# EAGLE board video-max5-revG (EAGLE 5.11)
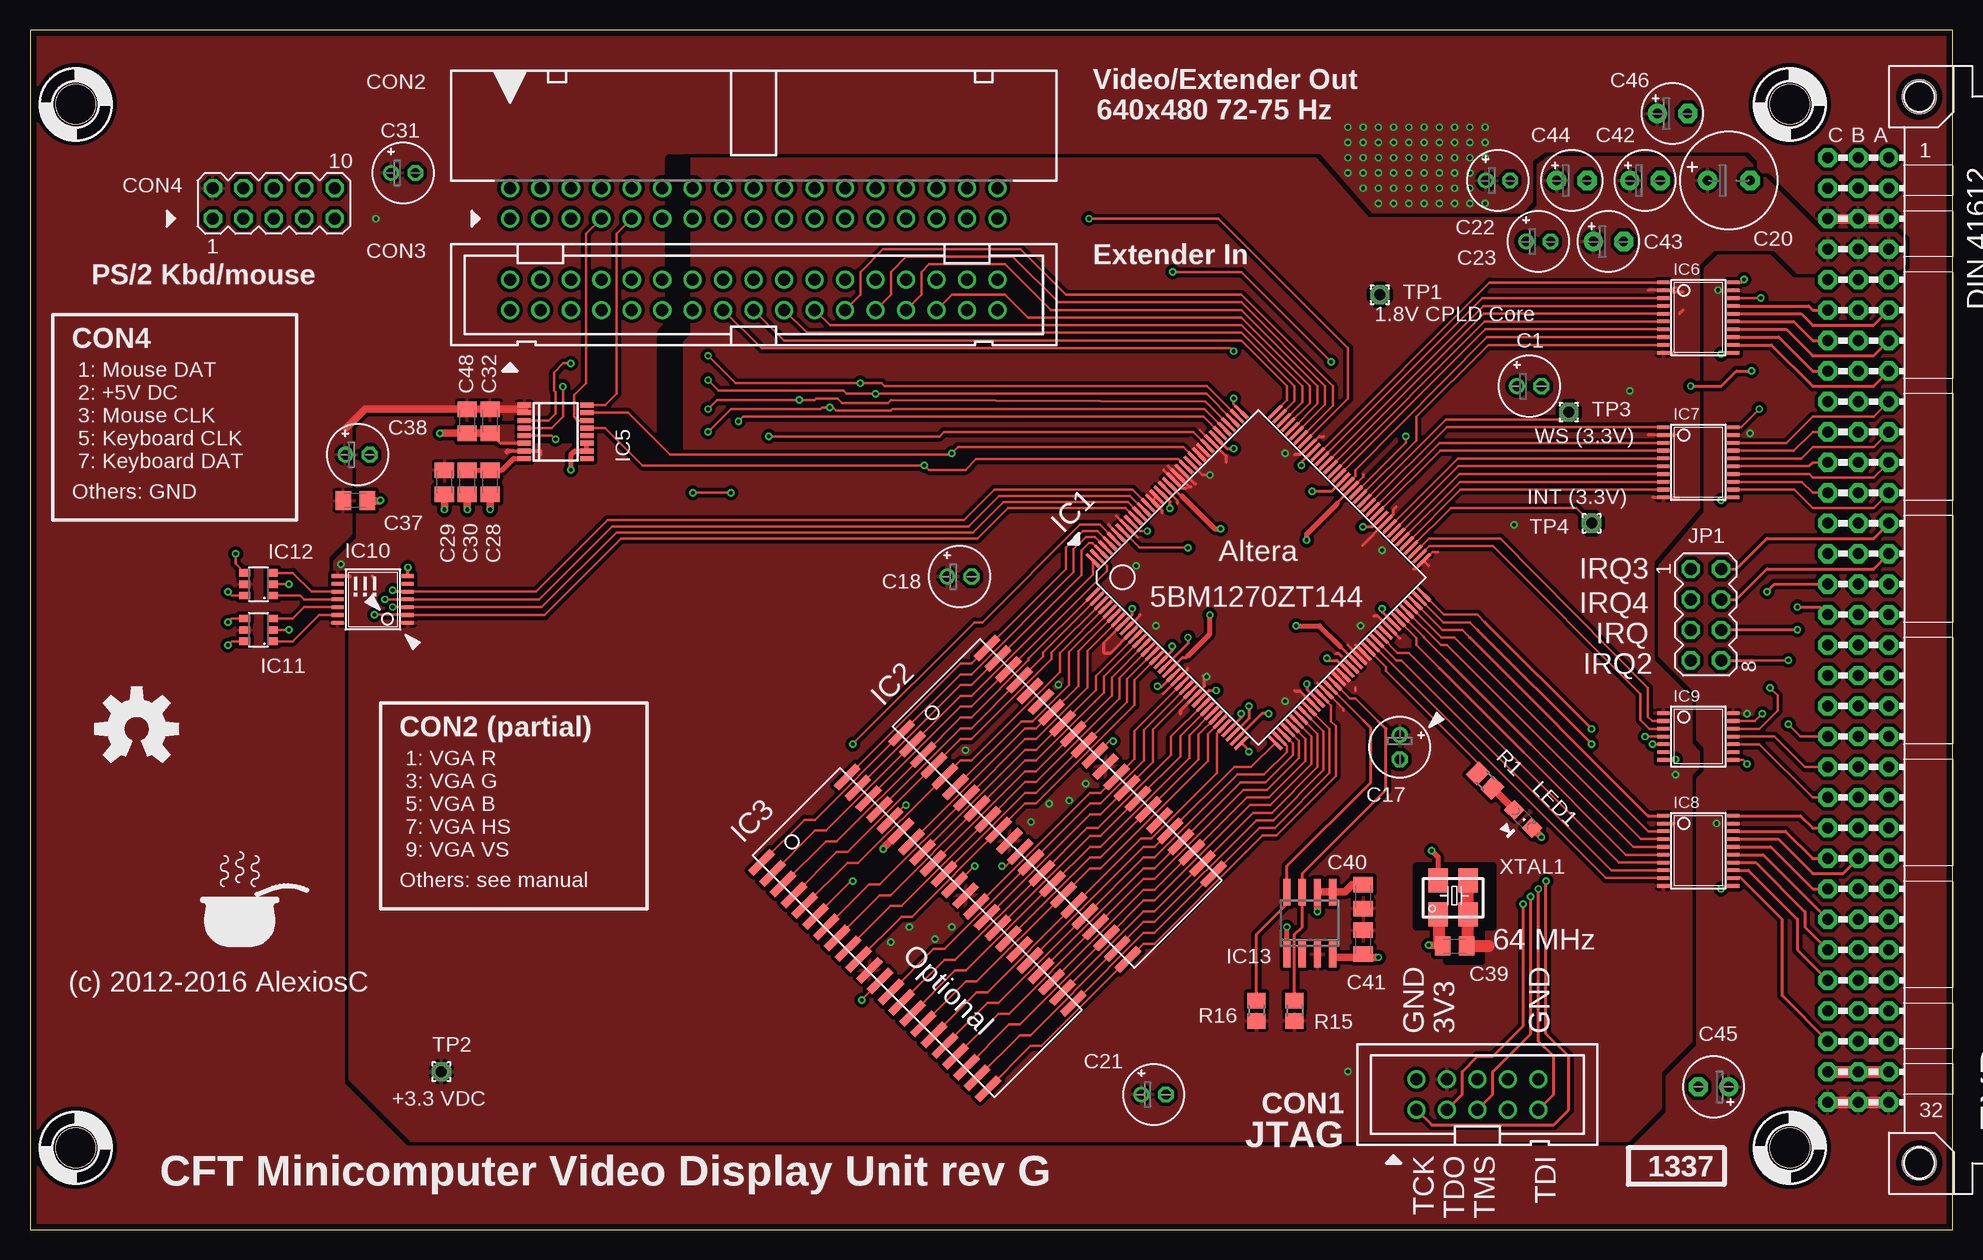
[diagram p5: board, top side]
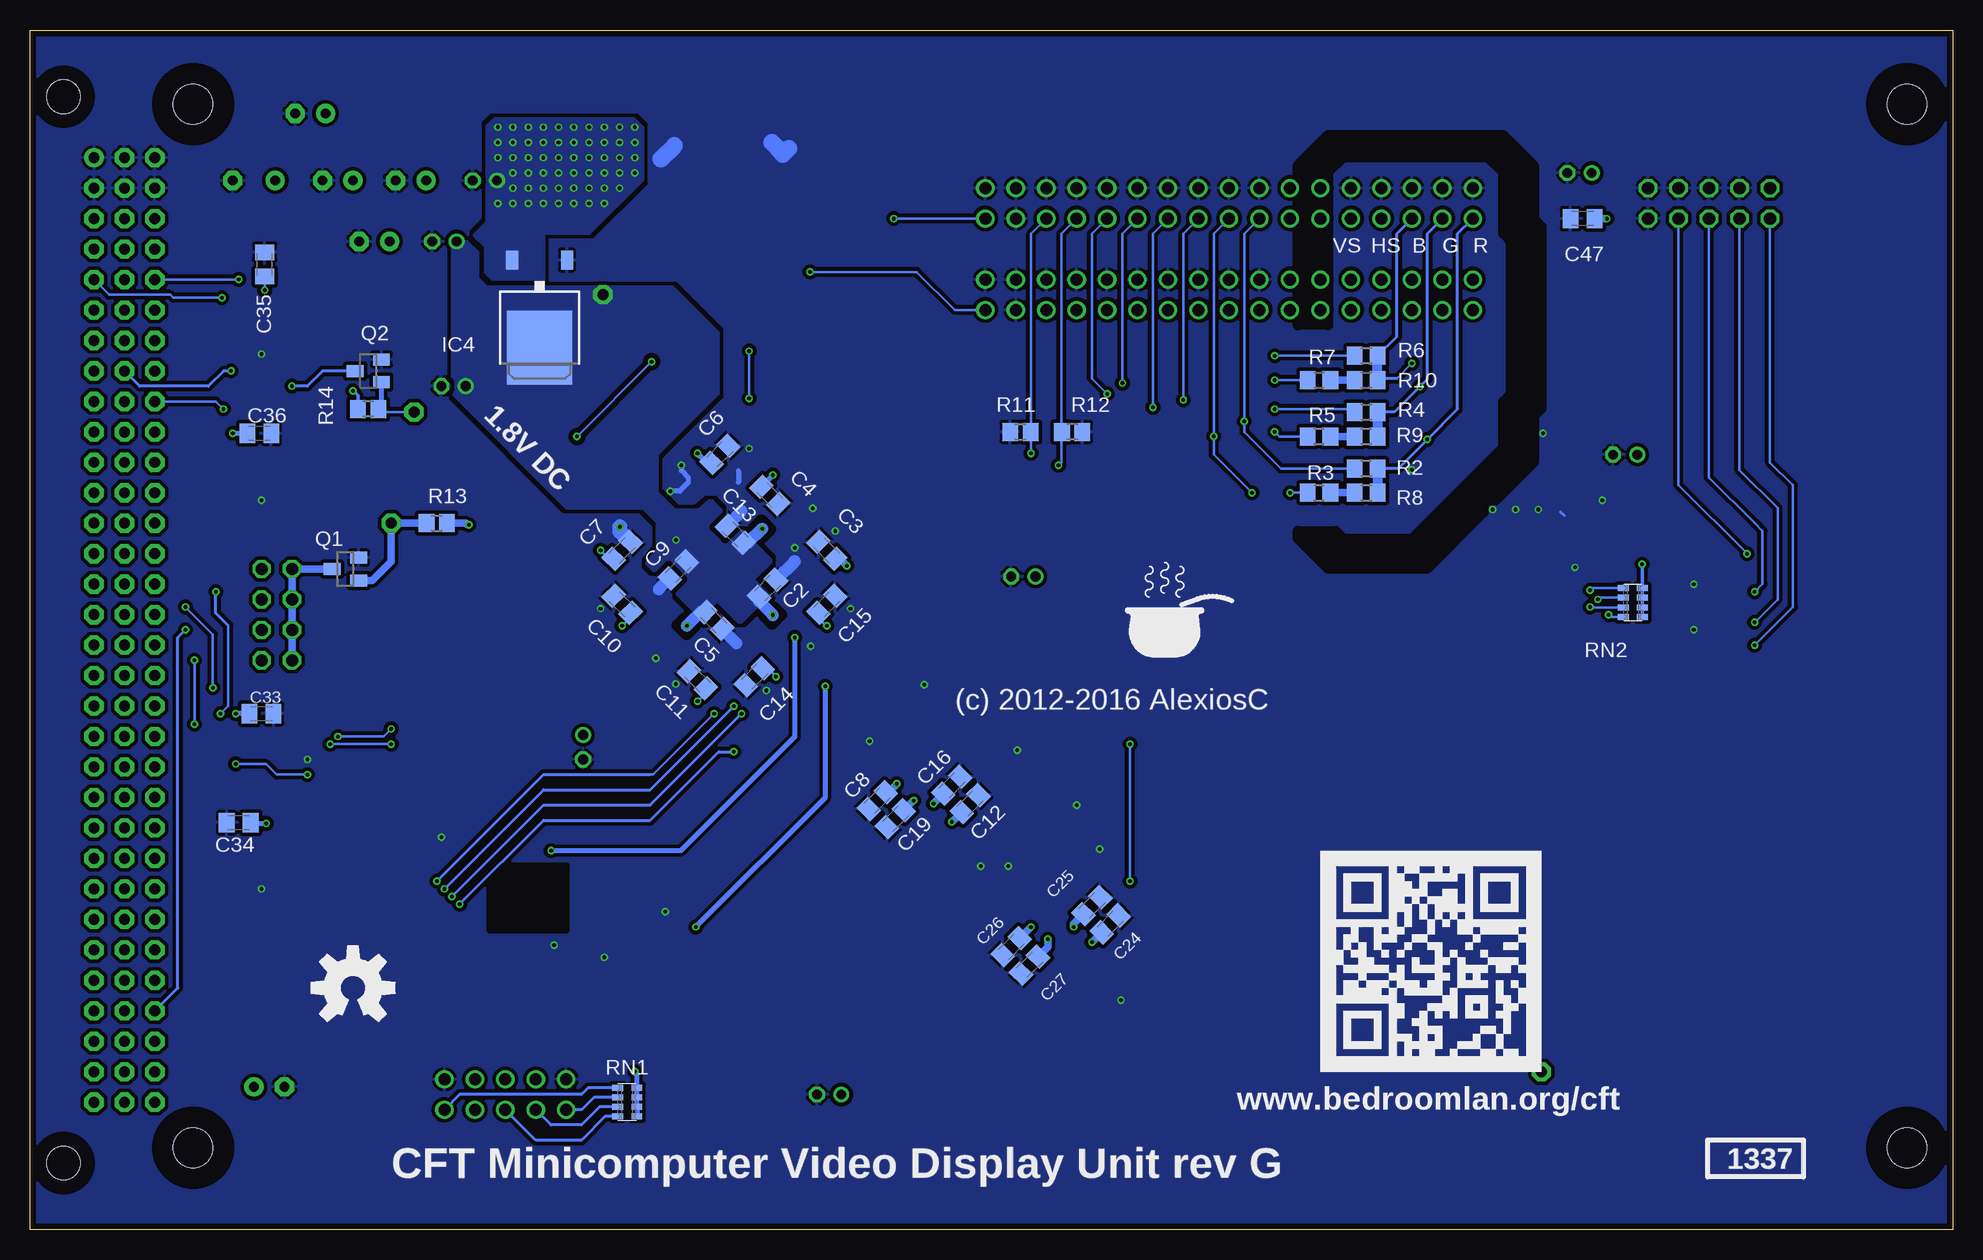
[diagram p6: board, bottom side, seen from below]

Size 160.27 x 100.03 mm. Coordinates in mm from the lower left corner, seen from the top.
Copper layers (1*16): Top 0.035mm / dielectric 1.5mm / Bottom 0.035mm
Design rules "smart-prototyping-1layer": minimum track width 7mil, minimum drill 12mil, track to track 7mil, track to pad 7mil, pad to pad 7mil, via to via 7mil, smd to smd 0mil, copper to edge 20mil, drill to drill 10mil, minimum pad ring 10mil, minimum via ring 6mil, stop-mask expansion 2mil, vias tented up to drill 25mil, thermal gap 10mil
Net classes: 0 default: width 0.203 mm, clearance 0.152 mm; 1 low power: width 1.27 mm, clearance 0.203 mm; 2 Power Rail: width 0.61 mm, clearance 0.254 mm; 3 3.3V power: width 0.61 mm, clearance 0.203 mm; 4 Analogue: width 0.406 mm, clearance 0.203 mm
tRestrict: area 115.6,25.2 to 121.6,30; area 118.1,22.4 to 121,26.2; area 115.6,25.6 to 121.6,30.3; area 115.9,25.2 to 121.9,30; area 115.9,25.6 to 121.9,30.3; area 41.9,65.9 to 45.7,67.2; area 52.7,64.7 to 54.6,89.3
bRestrict: area 98.6,57.8 to 99.9,59.2; area 104.9,49.6 to 106.3,51; area 97.7,50.5 to 99.1,51.9; area 115.6,25.6 to 121.6,30.3; area 115.6,25 to 121.9,30.3; area 34.3,55.1 to 54.6,91.3

## Footprints (pad centres in the part's own frame; a part is rotated, then mirrored left to right if it is on the bottom)
E2-5 = drill 0.813 pad 1.27 round: + -1.016,0 | drill 0.813 pad 1.27 octagon: - 1.016,0
C0805K = smd 1.3 x 1.6: 1 -1,0; 2 1,0
E3,5-8 = drill 0.813 pad 1.6 round: + -1.778,0 | drill 0.813 pad 1.6 octagon: - 1.778,0
E2,5-5 = drill 0.813 pad 1.6 round: + -1.27,0 | drill 0.813 pad 1.6 octagon: - 1.27,0
SHROUDED-HEADER-2X5-2.5MM = drill 1 pad 1.422 round: 1 -5.08,-1.27; 2 -5.08,1.27; 3 -2.54,-1.27; 4 -2.54,1.27; 5 0,-1.27; 6 0,1.27; 7 2.54,-1.27; 8 2.54,1.27; 9 5.08,-1.27; 10 5.08,1.27
PAK100/2500-5-34 = drill 1 pad 1.422 round: 1 -20.32,-1.27; 2 -20.32,1.27; 3 -17.78,-1.27; 4 -17.78,1.27; 5 -15.24,-1.27; 6 -15.24,1.27; 7 -12.7,-1.27; 8 -12.7,1.27; 9 -10.16,-1.27; 10 -10.16,1.27; 11 -7.62,-1.27; 12 -7.62,1.27; 13 -5.08,-1.27; 14 -5.08,1.27; 15 -2.54,-1.27; 16 -2.54,1.27; 17 0,-1.27; 18 0,1.27; 19 2.54,-1.27; 20 2.54,1.27; 21 5.08,-1.27; 22 5.08,1.27; 23 7.62,-1.27; 24 7.62,1.27; 25 10.16,-1.27; 26 10.16,1.27; 27 12.7,-1.27; 28 12.7,1.27; 29 15.24,-1.27; 30 15.24,1.27; 31 17.78,-1.27; 32 17.78,1.27; 33 20.32,-1.27; 34 20.32,1.27
PAK100/2500-34 = drill 1 pad 1.422 round: 1 -20.32,-1.27; 2 -20.32,1.27; 3 -17.78,-1.27; 4 -17.78,1.27; 5 -15.24,-1.27; 6 -15.24,1.27; 7 -12.7,-1.27; 8 -12.7,1.27; 9 -10.16,-1.27; 10 -10.16,1.27; 11 -7.62,-1.27; 12 -7.62,1.27; 13 -5.08,-1.27; 14 -5.08,1.27; 15 -2.54,-1.27; 16 -2.54,1.27; 17 0,-1.27; 18 0,1.27; 19 2.54,-1.27; 20 2.54,1.27; 21 5.08,-1.27; 22 5.08,1.27; 23 7.62,-1.27; 24 7.62,1.27; 25 10.16,-1.27; 26 10.16,1.27; 27 12.7,-1.27; 28 12.7,1.27; 29 15.24,-1.27; 30 15.24,1.27; 31 17.78,-1.27; 32 17.78,1.27; 33 20.32,-1.27; 34 20.32,1.27
MA05-2 = drill 1.016 octagon: 1 -5.08,-1.27; 2 -5.08,1.27; 3 -2.54,-1.27; 4 -2.54,1.27; 5 0,-1.27; 6 0,1.27; 7 2.54,-1.27; 8 2.54,1.27; 9 5.08,-1.27; 10 5.08,1.27
VG96K = drill 0.914 pad 1.6 round: A1 154.94,39.37 | drill 0.914 pad 1.6 octagon: A2 154.94,36.83; A3 154.94,34.29; A4 154.94,31.75; A5 154.94,29.21; A6 154.94,26.67; A7 154.94,24.13; A8 154.94,21.59; A9 154.94,19.05; A10 154.94,16.51; A11 154.94,13.97; A12 154.94,11.43; A13 154.94,8.89; A14 154.94,6.35; A15 154.94,3.81; A16 154.94,1.27; A17 154.94,-1.27; A18 154.94,-3.81; A19 154.94,-6.35; A20 154.94,-8.89; A21 154.94,-11.43; A22 154.94,-13.97; A23 154.94,-16.51; A24 154.94,-19.05; A25 154.94,-21.59; A26 154.94,-24.13; A27 154.94,-26.67; A28 154.94,-29.21; A29 154.94,-31.75; A30 154.94,-34.29; A31 154.94,-36.83; A32 154.94,-39.37; B1 152.4,39.37; B2 152.4,36.83; B3 152.4,34.29; B4 152.4,31.75; B5 152.4,29.21; B6 152.4,26.67; B7 152.4,24.13; B8 152.4,21.59; B9 152.4,19.05; B10 152.4,16.51; B11 152.4,13.97; B12 152.4,11.43; B13 152.4,8.89; B14 152.4,6.35; B15 152.4,3.81; B16 152.4,1.27; B17 152.4,-1.27; B18 152.4,-3.81; B19 152.4,-6.35; B20 152.4,-8.89; B21 152.4,-11.43; B22 152.4,-13.97; B23 152.4,-16.51; B24 152.4,-19.05; B25 152.4,-21.59; B26 152.4,-24.13; B27 152.4,-26.67; B28 152.4,-29.21; B29 152.4,-31.75; B30 152.4,-34.29; B31 152.4,-36.83; B32 152.4,-39.37; C1 149.86,39.37; C2 149.86,36.83; C3 149.86,34.29; C4 149.86,31.75; C5 149.86,29.21; C6 149.86,26.67; C7 149.86,24.13; C8 149.86,21.59; C9 149.86,19.05; C10 149.86,16.51; C11 149.86,13.97; C12 149.86,11.43; C13 149.86,8.89; C14 149.86,6.35; C15 149.86,3.81; C16 149.86,1.27; C17 149.86,-1.27; C18 149.86,-3.81; C19 149.86,-6.35; C20 149.86,-8.89; C21 149.86,-11.43; C22 149.86,-13.97; C23 149.86,-16.51; C24 149.86,-19.05; C25 149.86,-21.59; C26 149.86,-24.13; C27 149.86,-26.67; C28 149.86,-29.21; C29 149.86,-31.75; C30 149.86,-34.29; C31 149.86,-36.83; C32 149.86,-39.37 | hole 2.794: 157.48,44.45; 157.48,-44.45
TQFP144@1 = smd 0.27 x 1.5: 1 -8.75,-10.75; 2 -8.25,-10.75; 3 -7.75,-10.75; 4 -7.25,-10.75; 5 -6.75,-10.75; 6 -6.25,-10.75; 7 -5.75,-10.75; 8 -5.25,-10.75; 9 -4.75,-10.75; 10 -4.25,-10.75; 11 -3.75,-10.75; 12 -3.25,-10.75; 13 -2.75,-10.75; 14 -2.25,-10.75; 15 -1.75,-10.75; 16 -1.25,-10.75; 17 -0.75,-10.75; 18 -0.25,-10.75; 19 0.25,-10.75; 20 0.75,-10.75; 21 1.25,-10.75; 22 1.75,-10.75; 23 2.25,-10.75; 24 2.75,-10.75; 25 3.25,-10.75; 26 3.75,-10.75; 27 4.25,-10.75; 28 4.75,-10.75; 29 5.25,-10.75; 30 5.75,-10.75; 31 6.25,-10.75; 32 6.75,-10.75; 33 7.25,-10.75; 34 7.75,-10.75; 35 8.25,-10.75; 36 8.75,-10.75; 73 8.75,10.75; 74 8.25,10.75; 75 7.75,10.75; 76 7.25,10.75; 77 6.75,10.75; 78 6.25,10.75; 79 5.75,10.75; 80 5.25,10.75; 81 4.75,10.75; 82 4.25,10.75; 83 3.75,10.75; 84 3.25,10.75; 85 2.75,10.75; 86 2.25,10.75; 87 1.75,10.75; 88 1.25,10.75; 89 0.75,10.75; 90 0.25,10.75; 91 -0.25,10.75; 92 -0.75,10.75; 93 -1.25,10.75; 94 -1.75,10.75; 95 -2.25,10.75; 96 -2.75,10.75; 97 -3.25,10.75; 98 -3.75,10.75; 99 -4.25,10.75; 100 -4.75,10.75; 101 -5.25,10.75; 102 -5.75,10.75; 103 -6.25,10.75; 104 -6.75,10.75; 105 -7.25,10.75; 106 -7.75,10.75; 107 -8.25,10.75; 108 -8.75,10.75 | smd 1.5 x 0.27: 37 10.75,-8.75; 38 10.75,-8.25; 39 10.75,-7.75; 40 10.75,-7.25; 41 10.75,-6.75; 42 10.75,-6.25; 43 10.75,-5.75; 44 10.75,-5.25; 45 10.75,-4.75; 46 10.75,-4.25; 47 10.75,-3.75; 48 10.75,-3.25; 49 10.75,-2.75; 50 10.75,-2.25; 51 10.75,-1.75; 52 10.75,-1.25; 53 10.75,-0.75; 54 10.75,-0.25; 55 10.75,0.25; 56 10.75,0.75; 57 10.75,1.25; 58 10.75,1.75; 59 10.75,2.25; 60 10.75,2.75; 61 10.75,3.25; 62 10.75,3.75; 63 10.75,4.25; 64 10.75,4.75; 65 10.75,5.25; 66 10.75,5.75; 67 10.75,6.25; 68 10.75,6.75; 69 10.75,7.25; 70 10.75,7.75; 71 10.75,8.25; 72 10.75,8.75; 109 -10.75,8.75; 110 -10.75,8.25; 111 -10.75,7.75; 112 -10.75,7.25; 113 -10.75,6.75; 114 -10.75,6.25; 115 -10.75,5.75; 116 -10.75,5.25; 117 -10.75,4.75; 118 -10.75,4.25; 119 -10.75,3.75; 120 -10.75,3.25; 121 -10.75,2.75; 122 -10.75,2.25; 123 -10.75,1.75; 124 -10.75,1.25; 125 -10.75,0.75; 126 -10.75,0.25; 127 -10.75,-0.25; 128 -10.75,-0.75; 129 -10.75,-1.25; 130 -10.75,-1.75; 131 -10.75,-2.25; 132 -10.75,-2.75; 133 -10.75,-3.25; 134 -10.75,-3.75; 135 -10.75,-4.25; 136 -10.75,-4.75; 137 -10.75,-5.25; 138 -10.75,-5.75; 139 -10.75,-6.25; 140 -10.75,-6.75; 141 -10.75,-7.25; 142 -10.75,-7.75; 143 -10.75,-8.25; 144 -10.75,-8.75
SOJ44-4 = smd 0.635 x 2.54: 1 -13.335,-5.029; 2 -12.065,-5.029; 3 -10.795,-5.029; 4 -9.525,-5.029; 5 -8.255,-5.029; 6 -6.985,-5.029; 7 -5.715,-5.029; 8 -4.445,-5.029; 9 -3.175,-5.029; 10 -1.905,-5.029; 11 -0.635,-5.029; 12 0.635,-5.029; 13 1.905,-5.029; 14 3.175,-5.029; 15 4.445,-5.029; 16 5.715,-5.029; 17 6.985,-5.029; 18 8.255,-5.029; 19 9.525,-5.029; 20 10.795,-5.029; 21 12.065,-5.029; 22 13.335,-5.029; 23 13.335,5.029; 24 12.065,5.029; 25 10.795,5.029; 26 9.525,5.029; 27 8.255,5.029; 28 6.985,5.029; 29 5.715,5.029; 30 4.445,5.029; 31 3.175,5.029; 32 1.905,5.029; 33 0.635,5.029; 34 -0.635,5.029; 35 -1.905,5.029; 36 -3.175,5.029; 37 -4.445,5.029; 38 -5.715,5.029; 39 -6.985,5.029; 40 -8.255,5.029; 41 -9.525,5.029; 42 -10.795,5.029; 43 -12.065,5.029; 44 -13.335,5.029
TO252 = smd 1 x 1.6: 1 -2.28,-4.8; 2 2.28,-4.8 | smd 5.4 x 6.2: 3 0,2.5
SSOP16 = smd 0.419 x 1.143: 1 -2.223,-2.6; 2 -1.587,-2.6; 3 -0.953,-2.6; 4 -0.318,-2.6; 5 0.318,-2.6; 6 0.953,-2.6; 7 1.587,-2.6; 8 2.223,-2.6; 9 2.223,2.6; 10 1.587,2.6; 11 0.953,2.6; 12 0.318,2.6; 13 -0.318,2.6; 14 -0.953,2.6; 15 -1.587,2.6; 16 -2.223,2.6
TSSOP20 = smd 0.305 x 0.991: 1 -2.925,-2.918; 2 -2.275,-2.918; 3 -1.625,-2.918; 4 -0.975,-2.918; 5 -0.325,-2.918; 6 0.325,-2.918; 7 0.975,-2.918; 8 1.625,-2.918; 9 2.275,-2.918; 10 2.925,-2.918; 11 2.925,2.918; 12 2.275,2.918; 13 1.625,2.918; 14 0.975,2.918; 15 0.325,2.918; 16 -0.325,2.918; 17 -0.975,2.918; 18 -1.625,2.918; 19 -2.275,2.918; 20 -2.925,2.918
TSSOP14 = smd 0.305 x 0.991: 1 -1.95,-2.918; 2 -1.3,-2.918; 3 -0.65,-2.918; 4 0,-2.918; 5 0.65,-2.918; 6 1.3,-2.918; 7 1.95,-2.918; 8 1.95,2.918; 9 1.3,2.918; 10 0.65,2.918; 11 0,2.918; 12 -0.65,2.918; 13 -1.3,2.918; 14 -1.95,2.918
SOT23-6 = smd 0.6 x 0.9: 1 -0.95,-1.15; 2 0,-1.15; 3 0.95,-1.15; 4 0.95,1.15; 5 0,1.15; 6 -0.95,1.15
SO08 = smd 0.6 x 2.2: 1 -1.905,-2.6; 2 -0.635,-2.6; 3 0.635,-2.6; 4 1.905,-2.6; 5 1.905,2.6; 6 0.635,2.6; 7 -0.635,2.6; 8 -1.905,2.6
MA04-2 = drill 1.016 octagon: 1 -3.81,-1.27; 2 -3.81,1.27; 3 -1.27,-1.27; 4 -1.27,1.27; 5 1.27,-1.27; 6 1.27,1.27; 7 3.81,-1.27; 8 3.81,1.27
CHIPLED_0805 = smd 1.2 x 1.2: A 0,-1.05; C 0,1.05
SOT23 = smd 1 x 1.4: 1 -0.95,-1.1; 2 0.95,-1.1; 3 0,1.1
R0805 = smd 1.3 x 1.5: 1 -0.85,0; 2 0.85,0
R0805' = smd 1.3 x 1.5: 1 -0.95,0; 2 0.95,0
CTS742C083 = smd 0.5 x 0.9: 1 -1.2,-0.8; 2 -0.4,-0.8; 3 0.4,-0.8; 4 1.2,-0.8; 5 1.2,0.8; 6 0.4,0.8; 7 -0.4,0.8; 8 -1.2,0.8
1,6/0,9 = drill 0.914 pad 1.6 octagon: 1 0,0
STANDOFF_28_60 = hole 3.302: 0,0
CRYSTAL-SMD-5X3.2MM = smd 1.6 x 2: 1 1.125,-1.475; 2 -1.375,-1.475; 3 -1.375,1.35; 4 1.125,1.35

## Placement (x,y rotation side)
$4_37_$1  SIGNATURESILK  [SIGNATURE]  68.58,47.47 0 bottom
$4_39_$  OSHW-LOGOL  [OSHW-LOGO-L]  8.89,41.76 0 top
$4_39_$1  OSHW-LOGOL  [OSHW-LOGO-L]  133.35,20.17 0 bottom
$4_40_$  QRCODE-CFT  [CFT-QRCODE]  52.7,13.18 0 bottom
C1  47uF  [E2-5]  124.97,70.33 0 top
C2  0.1uF  [C0805K]  98.8,53.5 225 bottom
C3  0.1uF  [C0805K]  93.86,56.64 315 bottom
C4  0.1uF  [C0805K]  98.61,61.23 315 bottom
C5  0.1uF  [C0805K]  103.29,50.8 135 bottom
C6  0.1uF  [C0805K]  102.76,64.66 225 bottom
C7  0.1uF  [C0805K]  110.92,56.64 45 bottom
C8  0.1uF  [C0805K]  89.66,35.79 225 bottom
C9  0.1uF  [C0805K]  106.23,55.04 45 bottom
C10  0.1uF  [C0805K]  110.92,52.15 315 bottom
C11  0.1uF  [C0805K]  104.63,45.86 135 bottom
C12  0.1uF  [C0805K]  81.92,35.53 45 bottom
C13  0.1uF  [C0805K]  101.49,57.99 315 bottom
C14  0.1uF  [C0805K]  99.89,46.12 45 bottom
C15  0.1uF  [C0805K]  93.86,52.15 45 bottom
C16  1uF  [C0805K]  83.44,37.06 45 bottom
C17  47uF  [E2-5]  114.17,40.23 270 top
C18  47uF  [E2-5]  77.47,54.46 0 top
C19  1uF  [C0805K]  88.14,34.26 225 bottom
C20  47uF  [E3,5-8]  141.6,87.48 0 top
C21  47uF  [E2-5]  93.66,11.28 0 top
C22  10uF  [E2-5]  122.36,87.48 0 top
C23  22uF  [E2-5]  125.73,82.4 0 top
C24  0.1uF  [C0805K]  70.23,25.5 45 bottom
C25  0.1uF  [C0805K]  71.75,27.03 45 bottom
C26  1uF  [C0805K]  78.49,23.6 225 bottom
C27  1uF  [C0805K]  76.96,22.07 225 bottom
C28  0.1uF  [C0805K]  38.35,62.33 270 top
C29  0.1uF  [C0805K]  34.54,62.33 270 top
C30  0.1uF  [C0805K]  36.45,62.33 270 top
C31  47uF  [E2-5]  31.11,88.11 0 top
C32  0.1uF  [C0805K]  36.45,67.41 270 top
C33  0.1uF  [C0805K]  140.97,43.03 0 bottom
C34  0.1uF  [C0805K]  142.88,33.95 180 bottom
C35  0.1uF  [C0805K]  140.72,80.49 90 bottom
C36  0.1uF  [C0805K]  141.16,66.4 0 bottom
C37  0.1uF  [C0805K]  27.11,60.81 0 top
C38  22uF  [E2-5]  27.3,64.62 0 top
C39  0.1uF  [C0805K]  118.75,23.66 0 top
C40  1uF  [C0805K]  111.12,27.79 90 top
C41  0.1uF  [C0805K]  111.12,23.98 270 top
C42  1uF  [E2,5-5]  134.62,87.48 0 top
C43  1uF  [E2,5-5]  131.57,82.4 0 top
C44  1uF  [E2,5-5]  128.52,87.48 0 top
C45  1uF  [E2,5-5]  140.34,11.91 180 top
C46  1uF  [E2,5-5]  136.91,93.07 0 top
C47  0.1uF  [C0805K]  30.86,84.3 180 bottom
C48  0.1uF  [C0805K]  38.35,67.41 270 top
CON1  JTAG-ALTERA  [SHROUDED-HEADER-2X5-2.5MM]  120.65,11.28 0 top
CON2  2534-5  [PAK100/2500-5-34]  60.33,85.57 0 top
CON3  2534-  [PAK100/2500-34]  60.33,77.95 0 top
CON4  [MA05-2]  20.32,85.57 0 top
EXP  [VG96K]  0,50.01 0 top
IC1  5M570ZT144  [TQFP144@1]  102.39,54.39 315 top
IC2  AS7C34098A  [SOJ44-4]  85.65,35.53 315 top
IC3  AS7C34098A  [SOJ44-4]  73.97,24.75 315 top
IC4  AP1117D18  [TO252]  117.79,76.05 180 bottom
IC5  TPD7S019-15DBQR  [SSOP16]  43.81,66.52 270 top
IC6  TXB0108PWR  [TSSOP20]  139.06,76.05 270 top
IC7  TXB0108PWR  [TSSOP20]  139.06,63.98 270 top
IC8  TXB0108PWR  [TSSOP20]  139.06,31.6 270 top
IC9  TXB0104PWR  [TSSOP14]  139.06,41.12 270 top
IC10  LSF0204PW  [TSSOP14]  28.57,52.55 90 top
IC11  KBMF01SC6  [SOT23-6]  19.05,50.01 90 top
IC12  KBMF01SC6  [SOT23-6]  19.05,53.82 90 top
IC13  DS1085L  [SO08]  106.68,25.57 0 top
JP1  [MA04-2]  139.7,51.28 270 top
LED1  LED-5MM-GREEN  [CHIPLED_0805]  124.46,34.26 225 top
Q1  BSS138  [SOT23]  133.99,55.09 90 bottom
Q2  BSS138  [SOT23]  132.08,71.6 90 bottom
R1  330R  [R0805]  121.28,37.44 315 top
R2  412R  [R0805']  48.9,63.47 0 bottom
R3  412R  [R0805']  52.83,61.44 0 bottom
R4  412R  [R0805']  48.9,68.17 0 bottom
R5  412R  [R0805']  52.83,66.14 0 bottom
R6  412R  [R0805']  48.9,72.87 0 bottom
R7  412R  [R0805']  52.83,70.84 0 bottom
R8  412R  [R0805']  48.9,61.44 0 bottom
R9  412R  [R0805']  48.9,66.14 0 bottom
R10  412R  [R0805']  48.9,70.84 0 bottom
R11  4k7  [R0805]  77.72,66.52 0 bottom
R12  4k7  [R0805]  73.41,66.52 180 bottom
R13  4k7  [R0805]  126.36,58.9 0 bottom
R14  4k7  [R0805]  132.08,68.43 180 bottom
R15  4k7  [R0805]  105.41,18.26 270 top
R16  4k7  [R0805]  102.23,18.26 270 top
RN1  4.7k  [CTS742C083]  110.49,10.64 270 bottom
RN2  4.7k  [CTS742C083]  26.67,52.3 270 bottom
TP1  [1,6/0,9]  112.52,77.95 0 top
TP2  [1,6/0,9]  34.29,13.18 0 top
TP3  [1,6/0,9]  128.27,68.17 0 top
TP4  [1,6/0,9]  130.18,58.9 180 top
U1  HOLE  [STANDOFF_28_60]  3.81,93.83 0 top
U2  HOLE  [STANDOFF_28_60]  3.81,6.83 0 top
U3  HOLE  [STANDOFF_28_60]  146.69,93.83 0 top
U4  HOLE  [STANDOFF_28_60]  146.69,6.83 0 top
U$1  SIGNATURESILK  [SIGNATURE]  14.61,23.34 0 top
XTAL1  64.000  [CRYSTAL-SMD-5X3.2MM]  118.75,27.79 0 top

## Tracks (layer width: path | path; a pad name or v marks a point on that pad's centre or on a via)
!CE0
  Top 0.203: IC2.6 82.63,42.39 83.57,42.39 86.61,45.44 86.61,48.16 IC1.5
!CE1  (via drill 0.3)
  Top 0.203: IC3.6 68.4,29.06 v68.58,29.06 | IC1.139 89.17,58.78 87.5,58.78 79.38,50.65 78.74,50.65 v68.58,40.49
  Bottom 0.203: v68.58,29.06 v68.58,40.49
!IODEV1XX
  Top 0.254: IC8.17 145.71,32.57 148.59,29.69 151.13,29.69 EXP.B24
!IODEV1XX-3V3
  Top 0.203: IC1.68 117.59,48.74 118.11,48.74 134.28,32.57 IC8.4
!IRQ  (via drill 0.3)
  Top 0.254: v147.32,50.01 JP1.6
  Bottom 0.254: EXP.C29 147.96,20.17 147.96,49.38 v147.32,50.01
!IRQ2  (via drill 0.3)
  Top 0.203: 143.51,47.47 v146.56,47.47 | v146.56,42.14 147.57,41.12 EXP.C20
  Top 0.254: JP1.8 143.51,47.47
  Bottom 0.203: v146.56,47.47 v146.56,42.14
!IRQ3
  Top 0.254: JP1.2 142.24,55.09 144.78,57.63 153.67,57.63 EXP.A13
!IRQ4
  Top 0.254: JP1.4 142.24,52.55 144.78,55.09 153.67,55.09 EXP.A14
!PR
  Top 0.203: IC3.41 77.57,41.82 78.46,41.82 IC2.41 84.45,47.81 84.45,48.13 IC1.2
!PW
  Top 0.203: IC3.17 78.91,19.81 79.81,19.81 IC2.17 92.61,32.61 93.47,32.61 98.93,38.07 98.93,41.39 IC1.32
!R  (via drill 0.3)
  Top 0.203: IC9.13 143.78,42.41 v144.4,43.03
  Top 0.254: v144.78,53.19 145.41,53.82 EXP.C15
  Bottom 0.203: 143.76,50.39 143.76,43.66 v144.4,43.03
  Bottom 0.254: 143.76,50.39 144.78,51.41 v144.78,53.19
!R-3V3
  Top 0.203: IC1.75 116.59,57.63 122.56,57.63 134.87,45.19 134.87,42.77 135.22,42.42 IC9.2
!RESET
  Top 0.254: IC8.12 142.61,29.32 146.05,25.88 146.05,19.53 EXP.C30
!RESET-3V3
  Top 0.203: IC1.60 131.35,29.32 IC8.9
!W  (via drill 0.3)
  Top 0.203: IC9.12 144.15,41.76 145.67,43.28 145.67,44.55 v145.03,45.19
  Top 0.254: v147.32,51.92 149.22,51.92 EXP.C16
  Bottom 0.203: v145.03,45.19 145.03,49.63 v147.32,51.92
!W-3V3
  Top 0.203: IC1.74 116.66,57 121.92,57 134.24,44.68 134.24,42.52 134.99,41.77 IC9.3
!WS  (via drill 0.3)
  Top 0.254: v138.43,70.33 140.97,70.33 142.24,71.6 v143.51,71.6
  Bottom 0.254: EXP.B8 151.13,70.33 145.41,70.33 144.15,71.6 v143.51,71.6 | v138.43,70.33 137.16,70.33 135.89,71.6 Q2.3
+3V3  (via drill 0.3)
  Top 0.203: IC1.25 97.9,45.31 | 97.9,45.31 | IC1.58 111.2,48.03 110.49,48.74 | IC1.57 110.87,47.72 109.86,48.74 | 110.49,44.93 110.49,45.23 | v98.35,62.92 97.75,62.92 IC1.121 | IC1.116 97.54,66.67 | IC9.8 142.79,39.17 v143.13,38.84 | 106.93,65.63 106.91,65.63 IC1.100 | IC1.127 95.63,60.8 95.63,60.55 | IC1.138 90.93,57.72 90.95,57.72 | IC1.136 91.59,58.48 | 91.59,58.48 | 107.31,45.57 107.33,45.57 IC1.49 109.47,43.42 109.47,43.28 | 115.32,55.09 115.49,55.09 116.17,55.77 | 116.27,55.87 116.21,55.81 IC1.73 116.17,55.8 116.17,55.77 | 116.17,55.77 116.89,56.49 117.35,56.49
  Top 0.254: 111.09,57.08 IC1.82 113.67,59.66 113.67,60.04 113.89,60.26 | 114.19,49.31 IC1.64 112.34,51.16 112.01,51.16 | IC1.136 92.35,57.72 | IC1.9 92.55,51.27 | IC1.100 105.89,64.62 105.41,64.62 | IC1.116 99.69,64.51 99.69,63.98 | 94.44,44.68 IC1.21 96.52,46.76 96.52,46.84 | IC1.46 105.84,44.93 105.41,44.93 | 109.3,47.83 109.1,48.03 108.88,48.03 | 97.9,45.31 97.9,46.09 97.79,46.2 | 91.59,58.48 90.53,59.54 | 137.49,76.37 137.79,76.68 | 136.9,78.32 IC6.2 134.88,78.32 | 136.9,78.32 137.16,78.59 | IC6.10 137.04,73.12 137.16,73 | 136.9,78.32 137.01,78.21 137.79,78.21 | 137.16,66.27 137.15,66.26 IC7.2 134.88,66.26 | 137.16,61.06 | 135.25,61.06 135.26,61.06 IC7.10 137.42,61.06 | IC1.73 116.18,55.76 116.59,55.35 | IC8.2 137.02,33.87 137.03,33.88 | 94.49,63.35 94.5,63.35 IC1.125 96.02,61.82 | 94.87,63.68 IC1.124 96.6,61.95 96.77,61.95 | 95.5,63.73 95.53,63.73 IC1.123 97.05,62.2 97.16,62.2 | 96.02,61.82 96.39,61.82 | 96.02,61.82 96.01,61.82 | 106.93,65.63 107.44,66.14 107.82,66.14 | 94.36,59.79 94.36,59.95 IC1.130 IC1.129 | 90.95,57.72 89.89,58.78
  Top 0.305: XTAL1.1 119.87,24.12 120.02,23.98 | IC1.25 95.89,43.29 95.89,43.03 | 28.53,54.5 28.57,54.46 | IC10.8 26.62,54.5 26.67,54.46 | 39.81,64.94 IC5.7 42.55,64.94 42.55,64.62
  Top 0.406: 39.81,64.94 39.75,64.87
  Top 1.016: XTAL1.4 XTAL1.1 119.87,23.78 C39.2 121.6,23.66
  Bottom 0.203: v143.13,38.84 140.59,38.84 139.7,37.95 v137.16,37.95 | 25.87,55.44 v25.91,55.47
  Bottom 0.254: v98.09,46.12 98.8,46.82 C14.2 | C6.2 103.93,64.01 | C10.2 110.21,51.06 v110.92,50.35 | C3.2 92.77,55.93 | C7.1 112.01,55.93 v112.72,56.64 | C11.1 103.93,44.77 v104.63,44.07 | C15.1 94.56,51.06 v93.86,50.35 | 99.06,62.22 C4.1 | v123.7,58.78 123.83,58.78 | C8.1 88.83,36.9
  Bottom 0.305: R14.2 132.93,69.53 v133.35,69.95 | RN2.5 RN2.6 RN2.7 RN2.8 25.87,55.44
  Bottom 0.406: RN1.5 RN1.6 RN1.7 RN1.8 109.69,13.02 v109.86,13.18 | v98.35,62.92 99.06,62.22 | 103.93,64.01 v104.63,64.72
  Bottom 0.61: 123.83,58.78 123.95,58.9 R13.2 | v83.44,34.01 C12.1 82.5,34.83 | v84.96,35.53 C16.1 | C19.1 v86.61,35.79 | 88.65,36.42 88.76,36.42 88.83,36.5 C8.1 88.7,36.5 v88.01,37.19 | C24.1 v71.75,23.98 | C25.1 73.28,25.5 v73.28,25.25 | C26.1 v76.83,25.25 | C27.1 75.44,23.6 v75.44,24.23 | 92.77,55.93 92.2,55.36 v92.2,55.35
  pour Top (isolate 0.305, rank 3): 107.19,89.26 33.53,89.26 29.84,85.57 29.84,83.03 27.3,80.49 27.3,57.63 25.4,55.73 25.4,54.46 26.67,54.46 26.67,12.55 31.75,7.47 133.22,7.47 135.89,10.13 135.89,13.18 138.43,15.72 138.43,29.69 138.43,37.95 139.06,38.58 139.06,39.85 138.43,40.49 138.43,44.3 135.25,47.47 135.25,55.73 139.06,60.17 139.06,80.49 140.34,81.76 145.41,81.76 147.32,79.86 155.57,79.86 156.21,80.49 156.21,82.4 155.57,83.03 149.22,83.03 142.88,89.38 126.62,89.38 125.73,88.75 125.73,85.32 124.71,84.3 111.51,84.3
  pour Top (isolate 0.254, no thermals): 97.16,66.52 95.89,65.25 97.79,63.35 99.31,64.87 97.66,66.52
  pour Top (isolate 0.254, rank 2, no thermals): 107.82,46.46 110.74,49.25 112.39,47.47 112.39,45.44 110.87,43.92 110.49,44.3 109.98,44.3
  pour Top (isolate 0.406): 113.03,58.9 113.67,58.9 119.13,64.36 119.13,65 117.6,65 112.39,59.79 112.39,59.54
  pour Top (isolate 0.254, rank 2, no thermals): 94.61,59.79 95.89,61.06 94.23,62.71 93.73,62.71 92.71,61.7
  pour Top (isolate 0.254, no thermals): 96.01,61.82 96.14,61.82 96.77,62.46 95.5,63.73 94.49,63.73 94.49,63.35
  pour Top (isolate 0.254, rank 3, no thermals): 88.77,58.27 89.53,59.03 91.57,57.12 90.81,56.36
+12V
  Top 1.016: EXP.C31 EXP.B31 EXP.A31
AB0  (via drill 0.3)
  Top 0.203: IC6.18 144.25,77.67 v144.27,77.7
  Bottom 0.203: v144.27,77.7 148.34,77.7 148.59,77.95 153.67,77.95 EXP.A5
AB0-3V3
  Top 0.203: IC1.97 121.07,77.67 IC6.3
AB1
  Top 0.254: IC6.16 147.63,76.37 148.59,75.41 153.67,75.41 EXP.A6
AB1-3V3
  Top 0.203: IC1.95 121.19,76.37 IC6.5
AB2
  Top 0.254: IC6.14 146.39,75.07 148.59,72.87 153.67,72.87 EXP.A7
AB2-3V3
  Top 0.203: IC1.93 121.3,75.07 IC6.7
AB3
  Top 0.254: IC6.12 145.15,73.77 148.59,70.33 153.67,70.33 EXP.A8
AB3-3V3
  Top 0.203: IC1.88 115.57,65.81 115.57,67.79 121.55,73.77 IC6.9
AB4
  Top 0.203: IC7.18 146.41,65.61 148.59,67.79 153.67,67.79 EXP.A9
AB4-3V3
  Top 0.203: IC1.85 117.49,65.61 IC7.3
AB5
  Top 0.203: IC7.16 147.65,64.31 148.59,65.25 153.67,65.25 EXP.A10
AB5-3V3
  Top 0.203: IC1.81 119.02,64.31 IC7.5
AB6
  Top 0.203: IC7.14 148.29,63.01 148.59,62.71 153.67,62.71 EXP.A11
AB6-3V3
  Top 0.203: IC1.79 119.14,63.01 IC7.7
AB7
  Top 0.203: IC7.12 147.06,61.71 148.59,60.17 153.67,60.17 EXP.A12
AB7-3V3
  Top 0.203: IC1.77 119.25,61.71 IC7.9
B0  (via drill 0.3)
  Top 0.203: IC1.110 98.12,70.33 71.25,70.33 70.99,70.59 v69.22,70.59 58.8,70.59 v56.52,72.87
  Bottom 0.203: CON2.23 69.22,83.03 v69.22,70.59 | R6.1 v56.52,72.87
B0-IN
  Top 0.203: CON3.23 69.22,77.95 69.22,79.86 71.12,81.76 82.55,81.76 86.36,77.95 100.97,77.95 108.58,70.33 108.58,68.72 IC1.102
B1  (via drill 0.3)
  Top 0.203: IC1.111 98.05,69.7 v70.48,69.7 68.07,69.7 67.82,69.95 57.4,69.95 v56.52,70.84
  Bottom 0.203: CON2.25 71.75,83.03 71.75,70.97 v70.48,69.7 | R7.1 v56.52,70.84
B1-IN
  Top 0.203: CON3.25 71.75,77.95 71.75,79.86 73.03,81.13 81.92,81.13 85.72,77.32 100.97,77.32 107.95,70.33 107.95,68.79 IC1.103
BLUE  (via drill 0.3)
  Top 0.203: IC5.3 43.24,67.48 43.81,68.05 43.81,69.82 43.69,69.95 43.69,71.48 44.45,72.24 v45.09,72.24
  Bottom 0.203: v45.09,72.24 46.35,70.97 | 47.82,70.97 R10.2
  Bottom 0.254: CON2.5 46.35,83.03 46.35,74.46 R6.2 | 46.35,70.97 47.82,70.97
  Bottom 0.305: R6.2 47.82,72.75
  Bottom 0.813: R10.2 R6.2
CG/!P!
  Top 0.203: IC3.44 77.57,47.2 78.46,47.2 IC2.44 79.78,48.51 86.36,55.09 86.36,56.87 87.76,58.27 88.97,58.27 IC1.140
CLK  (via drill 0.3)
  Top 0.254: IC1.18 96.52,48.88 v96.52,49.38
  Top 0.406: v116.84,31.6 117.37,31.07 XTAL1.3
  Bottom 0.406: v96.52,49.38 96.52,41.12 106.05,31.6 v116.84,31.6
DB0  (via drill 0.3)
  Top 0.203: IC6.20 142.62,78.97 v142.88,79.22
  Bottom 0.203: v142.88,79.22 EXP.C5
DB0-3V3
  Top 0.203: IC1.98 121.67,78.97 IC6.1
DB1
  Top 0.254: IC6.17 148.25,77.02 148.59,76.68 EXP.C6
DB1-3V3
  Top 0.203: IC1.96 121.13,77.02 IC6.4
DB2
  Top 0.254: IC6.15 147.01,75.72 148.59,74.14 EXP.C7
DB2-3V3
  Top 0.203: IC1.94 121.24,75.72 IC6.6
DB3
  Top 0.254: IC6.13 145.77,74.42 148.59,71.6 EXP.C8
DB3-3V3
  Top 0.203: IC1.91 110.49,62.85 110.49,63.35 121.43,74.42 IC6.8
DB4  (via drill 0.3)
  Top 0.203: IC7.20 142.62,66.91 v144.15,68.43
  Bottom 0.203: v144.15,68.43 144.78,69.06 EXP.C9
DB4-3V3
  Top 0.203: IC1.86 118.08,66.91 IC7.1
DB5
  Top 0.203: IC7.17 147.03,64.96 148.59,66.52 EXP.C10
DB5-3V3
  Top 0.203: IC1.84 117.55,64.96 IC7.4
DB6
  Top 0.203: IC7.15 148.26,63.66 148.59,63.98 EXP.C11
DB6-3V3
  Top 0.203: IC1.80 119.08,63.66 IC7.6
DB7
  Top 0.203: IC7.13 147.68,62.36 148.59,61.44 EXP.C12
DB7-3V3
  Top 0.203: IC1.78 119.19,62.36 IC7.8
DB8
  Top 0.203: IC9.11 145.41,41.12 147.96,38.58 EXP.C21
DB8-3V3  (via drill 0.3)
  Top 0.203: IC1.72 117.87,51.28 120.65,51.28 121.28,50.65 | v134.62,41.12 IC9.4
  Top 0.254: 121.28,50.65 v130.18,41.76
  Bottom 0.203: v130.18,41.76 130.81,41.12 v134.62,41.12
DB9
  Top 0.203: IC9.10 144.16,40.47 148.59,36.04 EXP.C22
DB9-3V3  (via drill 0.3)
  Top 0.203: IC1.71 117.8,50.65 120.02,50.65 120.65,50.01 | 130.19,40.47 130.21,40.49 | v135.25,40.49 135.27,40.47 IC9.5
  Top 0.254: 120.65,50.01 v130.18,40.49 130.19,40.47
  Bottom 0.203: v130.18,40.49 v135.25,40.49
DB10
  Top 0.254: IC8.20 147.57,34.52 148.59,33.5 EXP.C23
DB10-3V3
  Top 0.203: IC1.70 117.73,50.01 119.38,50.01 120.02,49.38
  Top 0.254: 120.02,49.38 134.87,34.52 IC8.1
DB11
  Top 0.254: IC8.18 146.33,33.22 148.59,30.96 EXP.C24
DB11-3V3
  Top 0.203: IC1.69 117.66,49.38 118.75,49.38 134.9,33.22 IC8.3
DB12
  Top 0.254: IC8.16 145.09,31.92 148.59,28.42 EXP.C25
DB12-3V3
  Top 0.203: IC1.67 116.2,49.42 116.2,49.38 118.11,47.47 | 125.1,40.48 133.66,31.92 IC8.5
  Top 0.254: 118.11,47.47 125.1,40.48
DB13
  Top 0.254: IC8.15 144.47,31.27 EXP.C26
DB13-3V3
  Top 0.203: IC1.66 115.57,49.34 115.57,48.74 117.47,46.84 | 124.48,39.83 133.04,31.27 IC8.6
  Top 0.254: 117.47,46.84 124.48,39.83
DB14
  Top 0.254: IC8.14 143.85,30.62 147.96,26.52 147.96,25.25 EXP.C27
DB14-3V3
  Top 0.203: IC1.62 113.98,48.11 114.94,48.11 132.42,30.62 IC8.7
DB15
  Top 0.254: IC8.13 143.23,29.97 147.32,25.88 147.32,23.34 EXP.C28
DB15-3V3
  Top 0.203: IC1.61 113.91,47.47 114.3,47.47 131.8,29.97 IC8.8
G0  (via drill 0.3)
  Top 0.203: IC1.112 97.97,69.06 71.75,69.19 71.5,68.94 67.69,68.94 67.31,69.32 65.53,69.32 65.41,69.19 v64.14,69.19 57.28,69.19 v56.52,68.43
  Bottom 0.203: CON2.19 64.14,83.03 v64.14,69.19 | R4.1 50.1,68.43 v56.52,68.43
G0-IN
  Top 0.203: CON3.19 64.77,74.78 100.97,74.78 105.41,70.33 105.41,69.08 IC1.107
G1  (via drill 0.3)
  Top 0.203: IC1.113 97.9,68.43 71.88,68.43 71.75,68.3 67.18,68.3 66.93,68.55 v66.67,68.55 66.04,68.55 65.91,68.43 58.42,68.43 v56.52,66.52
  Bottom 0.203: CON2.21 66.67,83.03 v66.67,68.55 | R5.1 56.13,66.14 v56.52,66.52
G1-IN
  Top 0.203: CON3.21 66.67,75.41 100.97,75.41 106.05,70.33 106.05,69.01 IC1.106
GND  (via drill 0.3)
  Top 0.203: C37.2 28.07,60.76 | 91.73,59.05 IC1.135 92.52,58.26 v93.14,58.26 | IC13.4 108.83,22.72 | C41.2 111.14,22.96 111.14,22.71 | IC7.11 141.22,61.06 v140.97,60.81 | IC9.7 137.12,39.17 v137.16,39.22 | IC8.11 141.22,28.67 v140.97,28.42 | v31.49,55.22 v31.5,55.22 | IC12.2 v21.59,53.82 | IC11.2 v21.59,50.01 | IC3.34 77.17,28.76 v78.74,30.33 | IC3.12 69.34,19.22 v69.34,19.15 | IC2.12 81.34,30.33 v81.03,30.33 | IC2.34 89.96,40.74 v90.3,40.74 | IC3.40 72.95,35.41 v73.03,35.41 | IC1.137 92.49,56.87 v96.52,56.87 | 29.16,60.76 v29.21,60.81
  Top 0.254: IC1.115 99.74,65.17 99.79,65.13 v100.33,65.13 | 105.98,64 IC1.99 | IC1.92 108.51,61.58 v106.89,61.58 | 111.91,58.61 IC1.83 | IC1.65 112.72,51.49 v112.72,51.79 | IC1.47 106.43,45.05 v106.43,45.5 | IC1.26 98.26,44.96 v98.89,44.96 | v91.88,51.79 91.88,51.31 IC1.8 89.53,48.96 89.53,48.11 90.09,48.11 IC1.10 | IC1.17 95.2,48.27 v95.2,48.65 | 105.98,64 | v105.98,63.73 105.98,64 | 111.91,58.61 | v111.1,58.61 111.91,58.61 | IC1.128 95.03,60.7 v95.03,60.14 | IC1.54 108.96,47.47 108.28,47.47 v108.1,47.66 | IC6.11 141.09,73.12 v140.97,73 | IC5.6 39.2,65.57 C48.2
  Top 0.305: IC10.7 v31.49,55.22
  Top 0.406: v45.09,63.35 45.09,64.62 45.4,64.94 IC5.10 IC5.11
  Top 0.61: v107.31,26.52 IC13.6 IC13.5 109.6,28.17 110.22,28.79 C40.2 | 111.14,22.71 v112.39,22.71 | v116.59,23.72 117.68,23.72 | 108.83,22.72 110.87,22.72 C41.2 | v125.98,32.74 LED1.C | v125.98,32.74 | C30.2 v36.45,60.05 | C28.2 v38.35,60.05 | C29.2 v34.54,60.05 | C48.2 C32.2 34.18,66.41 v34.16,66.4 | IC3.39 71.12,31.78 v71.12,31.72 | 28.07,60.76 29.16,60.76
  Top 1.016: XTAL1.2 117.47,26.21 117.47,23.93 C39.1 117.68,23.72
  Bottom 0.203: 32.38,59.54 32.7,59.86
  Bottom 0.406: v105.98,63.73 105.98,63.28 105.41,62.71 105.41,62.29 106.12,61.58 v106.89,61.58 | 100.97,59.93 100.97,60.17 | 101.22,63.26 101.22,62.33
  Bottom 1.016: 107.87,53.41 C9.1 | 101.4,48.92 C5.1 | C2.1 96.56,55.73 96.52,55.73 | C13.1 100.97,59.93
  Bottom 1.27: v111.1,58.61 111.1,58.23 C7.2
  Bottom 1.422: 106.55,90.4 107.7,89.26 | 98.42,90.65 97.54,89.76 | 97.54,89.64 97.03,90.14
  other vias: 77.98,39.98 85.72,45.44
  pour Bottom (isolate 0.305, rank 6): 0,100.02 160.02,100.18 160.02,0.48 0,0.48
  pour Top (isolate 0.305): 87.63,50.65 89.53,48.74 76.83,36.04 74.3,38.58 76.83,41.12 77.47,41.12 87,50.65
  pour Top (isolate 0.254, no thermals): 39.24,67.03 41.78,67.03 41.78,65.63 39.24,65.63
  pour Top (isolate 0.254, no thermals): 90.81,51.03 88.01,48.23 88.01,45.06 92.33,49.38 92.33,49.63 90.93,51.03
GREEN  (via drill 0.3)
  Top 0.203: IC5.4 43.5,66.84 44.45,67.79 44.45,70.27 v44.42,70.3
  Bottom 0.254: CON2.3 43.81,83.03 43.81,70.91 v44.42,70.3 46.55,68.17 R4.2
  Bottom 0.813: R4.2 R9.2
HS  (via drill 0.3)
  Top 0.203: IC1.122 95.73,64.24 78.87,64.24 77.98,63.35 74.93,63.35 v74.55,63.73 51.05,63.73 47.94,66.84 IC5.13
  Bottom 0.203: CON2.27 74.3,83.03 74.3,66.52 | 74.3,66.52 74.3,63.98 v74.55,63.73 | 74.3,66.52 R12.2
HS-IN
  Top 0.203: CON3.27 74.3,77.95 74.3,79.86 74.93,80.49 81.28,80.49 85.09,76.68 100.97,76.68 107.31,70.33 107.31,68.87 IC1.104
HS-TTL
  Top 0.203: CON2.7 46.35,83.03 46.35,70.59 45.34,69.57 45.34,67.79 45.66,67.48 IC5.14
INT
  Top 0.203: IC1.76 118.42,60.17 128.91,60.17 TP4.1
  Bottom 0.61: R13.1 TP4.1 130.18,55.73 131.76,54.14 Q1.1
KBCLK  (via drill 0.3)
  Top 0.203: IC1.131 91.9,61.7 80.39,61.7 77.85,59.16 48.13,59.16 42.18,53.2 IC10.5 30.46,53.2 30.35,53.31 v30.23,53.31
  Bottom 0.203: v30.23,53.31 30.04,53.5 RN2.1
KBCLK-5V  (via drill 0.3)
  Top 0.203: IC12.6 16.82,52.87 v16.51,53.19
  Bottom 0.203: v16.51,53.19 15.88,53.82 15.88,58.27 16.51,58.9 20.32,62.71 CON4.5
KBDAT  (via drill 0.3)
  Top 0.203: IC1.132 91.7,61.19 80.77,61.19 78.23,58.65 48.51,58.65 42.42,52.55 IC10.4 v29.59,52.55
  Bottom 0.203: v29.59,52.55 29.45,52.7 RN2.2
KBDAT-5V  (via drill 0.3)
  Top 0.203: IC12.4 17.14,55.53 v17.14,56.36
  Bottom 0.203: v17.14,56.36 22.86,62.08 CON4.7
MSCLK  (via drill 0.3)
  Top 0.203: IC1.133 91.51,60.68 81.15,60.68 78.61,58.14 48.9,58.14 42.66,51.9 IC10.3 31.48,51.92 v30.23,51.92
  Bottom 0.203: v30.23,51.92 30.21,51.9 RN2.3
MSCLK-5V  (via drill 0.3)
  Top 0.203: IC11.4 16.82,50.96 v16.51,50.65
  Bottom 0.203: v16.51,50.65 14.61,52.55 14.61,60.17 17.78,63.35 CON4.3
MSDAT  (via drill 0.3)
  Top 0.203: IC1.134 91.31,60.17 81.53,60.17 78.99,57.63 49.28,57.63 42.9,51.25 IC10.2 31.46,51.28 v28.7,51.28
  Bottom 0.203: v28.7,51.28 28.52,51.1 RN2.4
MSDAT-5V  (via drill 0.3)
  Top 0.203: IC11.6 16.82,49.06 v16.51,48.74
  Bottom 0.203: CON4.1 15.24,63.98 13.34,62.08 13.34,51.92 v16.51,48.74
N$1
  Bottom 0.61: R8.1 R3.2
N$2
  Bottom 0.61: R9.1 R5.2
N$3
  Bottom 0.61: R10.1 R7.2
N$4
  Bottom 0.61: JP1.7 JP1.5 JP1.3 JP1.1 Q1.3
N$6
  Top 0.406: C30.1 C28.1 38.37,63.35 39.37,63.35 40.32,64.3 IC5.8
N$7
  Top 0.203: IC10.13 24.1,51.25 21.91,49.06 IC11.1
N$8
  Top 0.203: IC10.12 22.88,51.9 22.86,51.92 21.91,50.96 IC11.3
N$9
  Top 0.203: IC12.1 22.54,52.87 22.86,52.55 IC10.11
N$10
  Top 0.203: IC12.3 21.91,54.77 23.48,53.2 IC10.10
N$341
  Top 0.203: 121.89,36.82 121.9,36.8 121.92,36.8 | R1.2 121.89,36.82 | 121.89,36.82 121.78,36.93
  Top 0.61: LED1.A R1.2
PA0
  Top 0.203: IC3.1 64.54,34.18 65.44,34.18 IC2.1 77.57,46.31 78.46,46.31 87,54.84 87,56.74 88.01,57.76 88.77,57.76 IC1.141
PA1
  Top 0.203: IC3.2 65.44,33.28 66.34,33.28 IC2.2 77.57,44.51 78.46,44.51 88.6,54.65 IC1.144
PA2
  Top 0.203: IC3.3 66.34,32.39 67.24,32.39 IC2.3 77.57,42.71 78.46,42.71 83.24,47.49 83.24,47.62 IC1.1
PA3
  Top 0.203: IC3.4 67.24,31.49 68.14,31.49 IC2.4 77.57,40.92 78.46,40.92 85.14,47.6 85.14,48.11 IC1.3
PA4
  Top 0.203: IC3.5 68.14,30.59 69.03,30.59 IC2.5 77.57,39.12 78.46,39.12 85.84,46.5 85.84,48.1 IC1.4
PA5
  Top 0.203: IC3.18 79.81,18.92 80.71,18.92 IC2.18 92.83,31.04 93.73,31.04 97.77,35.08 100.64,37.95 102.87,37.95 104.78,39.85 104.78,40.34 IC1.38
PA6
  Top 0.203: IC3.19 80.71,18.02 81.61,18.02 IC2.19 92.83,29.24 93.73,29.24 101.16,36.68 103.12,36.68 105.79,39.34 105.79,40.74 IC1.40
PA7
  Top 0.203: IC3.20 81.61,17.12 82.5,17.12 IC2.20 92.83,27.45 93.73,27.45 101.69,35.41 103.38,35.41 106.81,38.84 106.81,41.14 IC1.42 105.57,42.36
PA8
  Top 0.203: IC3.21 82.5,16.22 83.4,16.22 IC2.21 92.83,25.65 93.73,25.65 102.22,34.14 103.63,34.14 107.82,38.33 107.82,41.53 IC1.44
PA9
  Top 0.203: IC3.22 83.4,15.32 84.3,15.32 IC2.22 92.83,23.86 93.73,23.86 101.36,31.49 102.74,32.87 103.89,32.87 108.84,37.82 108.84,42.01 108.46,42.39 108.46,43.73 IC1.48
PA10
  Top 0.203: IC3.23 92.83,24.75 93.73,24.75 IC2.23 102.48,33.5 103.76,33.5 108.33,38.07 108.33,41.73 IC1.45
PA11
  Top 0.203: IC3.24 92.83,26.55 93.73,26.55 IC2.24 101.95,34.77 103.5,34.77 107.31,38.58 107.31,41.34 IC1.43
PA12
  Top 0.203: IC3.25 92.83,28.35 93.73,28.35 IC2.25 101.43,36.04 103.25,36.04 106.3,39.09 106.3,40.94 IC1.41
PA13
  Top 0.203: IC3.26 92.83,30.14 93.73,30.14 IC2.26 100.9,37.31 103,37.31 105.28,39.6 105.28,40.54 IC1.39
PA14
  Top 0.203: IC3.27 92.83,31.94 93.73,31.94 IC2.27 100.38,38.58 101.78,38.58 IC1.37
PA15
  Top 0.203: IC3.42 77.57,43.61 78.46,43.61 IC2.42 89.79,54.94 89.79,55.33 IC1.143
PB/!PC!
  Top 0.203: IC3.43 77.57,45.41 78.46,45.41 IC2.43 87.63,54.57 87.63,56.62 88.27,57.25 88.57,57.25 IC1.142
PCLK  (via drill 0.3)
  Top 0.254: IC1.20 95.31,46.26 94.36,45.31 v93.98,45.31
  Top 0.406: IC13.1 v104.78,25.25
  Bottom 0.406: v93.98,45.31 93.98,36.04 v104.78,25.25
PD0
  Top 0.203: IC3.7 69.93,28.79 70.83,28.79 IC2.7 82.95,40.92 83.85,40.92 88.14,45.2 88.14,48.27 IC1.7
PD1
  Top 0.203: IC3.8 70.83,27.9 71.73,27.9 IC2.8 82.95,39.12 83.85,39.12 88.79,44.06 89.53,44.8 89.53,46.14 IC1.12
PD2
  Top 0.203: IC3.9 71.73,27 72.63,27 IC2.9 82.95,37.33 83.85,37.33 90.81,44.28 90.81,45.99 IC1.14
PD3
  Top 0.203: IC3.10 72.63,26.1 73.53,26.1 IC2.10 82.95,35.53 83.85,35.53 92.08,43.75 92.08,45.85 IC1.16
PD4
  Top 0.203: IC3.13 75.32,23.41 76.22,23.41 IC2.13 88.34,35.53 89.24,35.53 92.84,39.13 92.84,41.66 IC1.23
PD5
  Top 0.203: IC3.14 76.22,22.51 77.12,22.51 IC2.14 88.11,33.5 89.03,33.5 95.12,39.6 95.12,41.12 IC1.27
PD6
  Top 0.203: IC3.15 77.12,21.61 78.02,21.61 IC2.15 88.34,31.94 89.24,31.94 96.65,39.34 96.65,41.23 IC1.29
PD7
  Top 0.203: IC3.16 78.02,20.71 78.91,20.71 IC2.16 88.34,30.14 89.24,30.14 98.17,39.07 98.17,41.34 IC1.31
PD8
  Top 0.203: IC3.29 88.34,31.04 89.24,31.04 IC2.29 97.41,39.21 97.41,41.28 IC1.30
PD9
  Top 0.203: IC3.30 88.34,32.84 89.24,32.84 IC2.30 95.89,39.48 95.89,41.17 IC1.28
PD10
  Top 0.203: IC3.31 88.34,34.63 89.24,34.63 IC2.31 93.6,38.99 93.6,41.72 IC1.24
PD11
  Top 0.203: IC3.32 88.34,36.43 89.24,36.43 IC2.32 92.08,39.26 92.08,41.6 IC1.22
PD12
  Top 0.203: IC3.35 82.95,36.43 83.85,36.43 IC2.35 91.44,44.02 91.44,45.92 IC1.15
PD13
  Top 0.203: IC3.36 82.95,38.22 83.85,38.22 IC2.36 90.17,44.54 90.17,46.06 IC1.13
PD14
  Top 0.203: IC3.37 82.95,40.02 83.85,40.02 IC2.37 88.85,45.02 88.85,46.16 IC1.11
PD15
  Top 0.203: IC3.38 82.95,41.82 83.85,41.82 IC2.38 87.38,45.34 87.38,48.23 90.35,51.21 IC1.6
PIXCLK  (via drill 0.3)
  Top 0.203: v88.27,84.3 99.06,84.3 109.86,73.51 109.86,69.28 IC1.101
  Bottom 0.203: CON2.33 v88.27,84.3
PIXCLK-IN  (via drill 0.3)
  Top 0.203: v114.68,66.14 114.68,65.62 IC1.89 | v95.25,79.86 100.97,79.86 v108.46,72.36
  Bottom 0.203: v108.46,72.36 v114.68,66.14 | CON3.33 83.19,76.68 86.36,79.86 v95.25,79.86
R0  (via drill 0.3)
  Top 0.203: IC1.114 97.83,67.79 59.44,67.79 v59.05,67.41
  Bottom 0.203: CON2.15 59.05,83.03 v59.05,67.41 59.05,66.52 56.01,63.47 R2.1
R0-IN  (via drill 0.3)
  Top 0.203: CON3.15 60.96,73.51 100.08,73.51 v100.33,73.25 | IC1.109 100.33,68.83 v100.33,69.32
  Bottom 0.203: v100.33,73.25 v100.33,69.32
R1  (via drill 0.3)
  Top 0.203: IC1.117 96.98,66.52 76.2,66.52 75.82,66.14 v61.59,66.14 | v55.24,61.44 v58.42,61.44
  Bottom 0.203: CON2.17 61.59,83.03 v61.59,66.14 61.59,64.62 v58.42,61.44 | R3.1 v55.24,61.44
R1-IN
  Top 0.203: CON3.17 62.87,74.14 100.97,74.14 104.78,70.33 104.78,69.15 IC1.108
RED  (via drill 0.3)
  Top 0.203: IC5.5 43.5,66.2 v43.81,65.89
  Bottom 0.254: CON2.1 41.27,83.03 41.27,68.43 v43.81,65.89 46.23,63.47 R2.2
  Bottom 0.813: R2.2 R8.2
SCL
  Top 0.203: 111.12,42.48 IC1.50
  Top 0.254: 111.12,42.48 111.76,41.84 111.76,37.31 104.78,30.33 IC13.8 104.78,27.15 102.23,24.61 R16.1
SDA
  Top 0.203: IC1.51 110.01,44.3 110.49,44.3 112.39,42.39
  Top 0.254: R15.1 105.41,24.61 106.05,25.25 IC13.7 106.05,29.69 113.03,36.68 113.03,41.76 112.39,42.39
STATUS
  Top 0.203: IC1.59 113.03,46.93 113.03,46.58 120.68,38.93 R1.1
TCK  (via drill 0.3)
  Top 0.254: IC1.35 102.69,43.03 v103.25,43.03 | CON1.1 116.84,8.74 127,8.74 128.27,10.01 128.27,14.45 126.36,16.36 v126.36,29.06
  Bottom 0.203: 108.58,37.95 108.33,37.95 v103.25,43.03
  Bottom 0.254: 108.58,37.95 117.47,37.95 v126.36,29.06 | RN1.2 113.27,11.04 114.3,10.01 CON1.1
TDI  (via drill 0.3)
  Top 0.254: CON1.9 127,11.28 127,14.45 125.73,15.72 v125.73,28.42 | IC1.34 101.6,42.64 v101.6,43.66
  Bottom 0.254: v125.73,28.42 117.47,36.68 108.58,36.68 v101.6,43.66 | RN1.1 113.73,11.84 114.3,11.28 124.46,11.28 CON1.9
TDO  (via drill 0.3)
  Top 0.254: IC1.36 101.6,39.98 v101.6,39.85 | v124.46,27.15 124.46,16.99 121.92,14.45 120.65,14.45 119.38,13.18 119.38,11.28 CON1.3
  Bottom 0.254: v101.6,39.85 102.87,39.85 108.58,34.14 117.47,34.14 v124.46,27.15 | RN1.3 112.8,10.24 114.3,8.74 116.84,8.74 CON1.3
TMS  (via drill 0.3)
  Top 0.254: IC1.33 100.97,42.72 v100.97,43.03 | v125.09,27.79 125.09,16.36 121.92,13.18 121.92,11.28 CON1.5
  Bottom 0.254: v100.97,43.03 108.58,35.41 117.47,35.41 v125.09,27.79 | RN1.4 112.33,9.44 114.3,7.47 118.11,7.47 CON1.5
VCC  (via drill 0.3)
  Top 0.406: C32.1 C48.1 | 26.35,66.84 26.23,66.84 | 41.22,68.43 IC5.1
  Top 0.61: 26.35,66.84 27.94,68.43 41.22,68.43
  Top 0.813: EXP.C3 EXP.B3 EXP.A3
  Top 1.016: EXP.A32 EXP.B32 EXP.C32
  Bottom 0.203: v140.72,78.33 C35.1
  Bottom 0.406: C34.1 141.88,33.88 v140.59,33.88 | C33.1 v143.13,43.03 | C36.1 v143.38,66.4
  Bottom 0.61: C47.1 v28.83,84.3
  other vias: 109.86,91.92 111.12,91.92 112.39,91.92 113.67,91.92 114.94,91.92 116.2,91.92 117.47,91.92 118.75,91.92 120.02,91.92 121.28,91.92 109.86,90.65 109.86,89.38 109.86,88.11 111.12,86.84 112.39,85.57 111.12,90.65 111.12,89.38 111.12,88.11 112.39,86.84 113.67,86.84 114.94,86.84 116.2,86.84 117.47,86.84 118.75,86.84 112.39,88.11 112.39,89.38 112.39,90.65 113.67,90.65 113.67,89.38 113.67,88.11 114.94,90.65 114.94,89.38 114.94,88.11 116.2,90.65 116.2,89.38 116.2,88.11 117.47,90.65 117.47,89.38 117.47,88.11 118.75,90.65 118.75,89.38 118.75,88.11 120.02,90.65 120.02,89.38 120.02,88.11 120.02,86.84 113.67,85.57 114.94,85.57 116.2,85.57 117.47,85.57 118.75,85.57 120.02,85.57 121.28,85.57 121.28,90.65 121.28,89.38
  pour Top (isolate 0.305, rank 6): 0,100.18 0,-0.15 160.66,-0.15 160.66,100.18
  pour Bottom (isolate 0.406, rank 2, no thermals): 109.22,91.92 109.22,87.48 113.67,83.03 117.47,83.03 117.47,77.19 123.95,77.19 123.83,79.86 123.83,82.4 122.17,84.05 122.17,92.05 121.54,92.68 109.98,92.68
  pour Top (isolate 0.254, no thermals): 38.73,68.94 41.78,68.94 41.78,68.05 38.73,68.05
VCCINT  (via drill 0.3)
  Top 0.203: IC1.90 111.12,62.78 111.12,62.97
  Top 0.254: 108.97,60.55 108.97,60.62 IC1.90 109.98,61.63 | IC1.19 96.08,47.73 96.39,47.73 96.52,47.85 | IC1.56 109.23,48.62 109.22,48.62 | IC1.126 95.95,61.19 96.01,61.19
  Top 0.305: v106.43,57.51 106.43,57.63
  Top 0.406: 108.97,60.55 106.43,58.02 106.43,57.63 106.43,57.54 | 96.52,47.85 98.35,49.68 v98.35,51.25 | 109.22,48.62 107.48,50.35 v105.53,50.35 | 96.01,61.19 98.77,58.43 v99.25,58.43
  Bottom 1.016: v99.25,58.43 100.4,57.28 C13.2 | v98.35,51.25 99.5,52.41 C2.2 | v105.53,50.35 104.38,51.51 C5.2
  pour Bottom (isolate 0.406, rank 5, no thermals): 103.4,60.8 98.52,55.92 98.52,55.63 arc90 98.55,55.6 99.95,54.2 98.68,52.93 100.97,50.65 101.22,50.65 103,52.43 104.14,51.28 104.67,51.28 107.47,54.09 108.92,55.54 107.95,56.74 107.95,58.9 106.55,60.05 104.52,60.05 103.64,60.8
  pour Bottom (isolate 0.406, no thermals): 106.68,78.59 122.17,78.59 122.94,79.35 122.94,81.51 123.83,82.4 125.09,82.4 125.09,69.7 115.57,60.17 109.22,60.17 107.31,58.27 106.05,59.54 107.95,61.44 107.95,64.62 102.87,69.7 102.87,74.78
  pour Top (isolate 0.406, no thermals): 109.86,62.08 110.87,61.19 114.68,65 114.68,67.54 109.86,62.71
VS  (via drill 0.3)
  Top 0.203: IC1.120 96.13,65.25 77.34,65.25 v76.83,64.74 76.71,64.62 53.34,64.62 49.85,68.11 IC5.15
  Bottom 0.203: CON2.29 76.83,83.03 76.83,66.52 | v76.83,64.74 76.83,66.52 | 76.83,66.52 R11.2
VS-IN
  Top 0.203: CON3.29 76.83,77.95 81.28,77.95 83.19,76.05 100.97,76.05 106.68,70.33 106.68,68.94 IC1.105
VS-TTL
  Top 0.203: CON2.9 48.9,83.03 48.9,69.7 47.94,68.75 IC5.16
WS
  Top 0.203: IC1.87 118.01,67.54 127.64,67.54 TP3.1
  Bottom 0.203: TP3.1 130.98,68.17 R14.1
  Bottom 0.406: Q2.1 130.98,68.43 R14.1

## Text on the board
tNames: Video/Extender Out | 640x480 72-75 Hz | PS/2 Kbd/mouse | Extender In | 1.8V CPLD Core | CON4 | 1: Mouse DAT | 2: +5V DC | 3: Mouse CLK | 5: Keyboard CLK | WS (3.3V) | 7: Keyboard DAT | Others: GND | INT (3.3V) | IRQ3 | Altera | IRQ4 | !!! | 5BM1270ZT144 | IRQ | IRQ2 | CON2 (partial) | 1: VGA R | 3: VGA G | 5: VGA B | 7: VGA HS | 9: VGA VS | Others: see manual | 64 MHz | Optional | (c) 2012-2016 AlexiosC | GND | 3V3 | GND | +3.3 VDC | JTAG | TCK | TDO | TMS | TDI | 1337 | CFT Minicomputer Video Display Unit rev G
bNames: R | G | G | B | HS | VS | 1.8V DC | (c) 2012-2016 AlexiosC | www.bedroomlan.org/cft | 1337 | CFT Minicomputer Video Display Unit rev G